# EAGLE design domus-silicea - M1 - Arduino Pro-Mini (EAGLE 7.3.0)
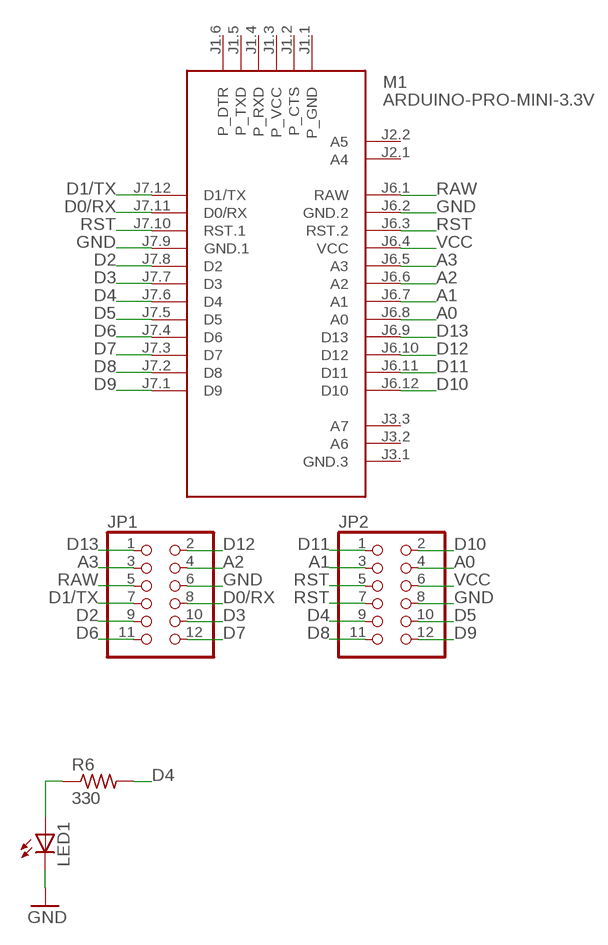
[diagram p0: schematic, sheet 1]

## Parts
JP1  PINHD-2X6  [2X06]
JP2  PINHD-2X6  [2X06]
LED1  LED5MM  [LED5MM]
M1  ARDUINO-PRO-MINI-3.3V  [ARDUINO-PRO-MINI]
R6  330  R-US_0204/7  [0204/7]

## Nets
A0: JP2.4 M1.J6.8(A0)
A1: JP2.3 M1.J6.7(A1)
A2: JP1.4 M1.J6.6(A2)
A3: JP1.3 M1.J6.5(A3)
D0/RX: JP1.8 M1.J7.11(D0/RX)
D1/TX: JP1.7 M1.J7.12(D1/TX)
D2: JP1.9 M1.J7.8(D2)
D3: JP1.10 M1.J7.7(D3)
D4: JP2.9 M1.J7.6(D4) R6.2
D5: JP2.10 M1.J7.5(D5)
D6: JP1.11 M1.J7.4(D6)
D7: JP1.12 M1.J7.3(D7)
D8: JP2.11 M1.J7.2(D8)
D9: JP2.12 M1.J7.1(D9)
D10: JP2.2 M1.J6.12(D10)
D11: JP2.1 M1.J6.11(D11)
D12: JP1.2 M1.J6.10(D12)
D13: JP1.1 M1.J6.9(D13)
GND: JP1.6 JP2.8 LED1.K(C) M1.J6.2(GND.2) M1.J7.9(GND.1)
N$6: LED1.A R6.1
RAW: JP1.5 M1.J6.1(RAW)
RST: JP2.5 JP2.7 M1.J6.3(RST.2) M1.J7.10(RST.1)
VCC: JP2.6 M1.J6.4(VCC)
Unconnected: M1.J1.1(P_GND) M1.J1.2(P_CTS) M1.J1.3(P_VCC) M1.J1.4(P_RXD) M1.J1.5(P_TXD) M1.J1.6(P_DTR) M1.J2.1(A4) M1.J2.2(A5) M1.J3.1(GND.3) M1.J3.2(A6) M1.J3.3(A7)

## Library data of the parts
JP1 JP2 = pinhead:PINHD-2X6: PIN HEADER
LED1 = led:LED: LED OSRAM: - CHIPLED LG R971, LG N971, LY N971, LG Q971, LY Q971, LO R971, LY R971 LH N974, LH R974 LS Q976, LO Q976, LY Q976 LO Q996 - Hyper CHIPLED LW Q18S LB Q993, LB Q99A, LB R99A - SideLED LS A670, LO A670, LY A670, LG A670, LP A670 LB A673, LV A673, LT A673, LW A673 LH A674 LY A675 LS A676, LA A676, LO A676, LY A676, LW A676 LS A679, LY A679, LG A679 - Hyper Micro SIDELED® LS Y876, LA Y876, LO Y876, LY Y876 LT Y87S - SmartLED LW L88C, LW L88S LB L89C, LB L89S, LG L890 LS L89K, LO L89K, LY L89K LS L896, LA L896, LO L896, LY L896 - TOPLED LS T670, LO T670, LY T670, LG T670, LP T670 LSG T670, LSP T670, LSY T670, LOP T670, LYG T670 LG T671, LOG T671, LSG T671 LB T673, LV T673, LT T673, LW T673 LH T674 LS T676, LA T676, LO T676, LY T676, LB T676, LH T676, LSB T676, LW T676 LB T67C, LV T67C, LT T67C, LS T67K, LO T67K, LY T67K, LW E67C LS E67B, LA E67B, LO E67B, LY E67B, LB E67C, LV E67C, LT E67C LW T67C LS T679, LY T679, LG T679 LS T770, LO T770, LY T770, LG T770, LP T770 LB T773, LV T773, LT T773, LW T773 LH T774 LS E675, LA E675, LY E675, LS T675 LS T776, LA T776, LO T776, LY T776, LB T776 LHGB T686 LT T68C, LB T68C - Hyper Mini TOPLED® LB M676 - Mini TOPLED Santana® LG M470 LS M47K, LO M47K, LY M47K Source: http://www.osram.convergy.de LUXEON: - LUMILED® LXK2-PW12-R00, LXK2-PW12-S00, LXK2-PW14-U00, LXK2-PW14-V00 LXK2-PM12-R00, LXK2-PM12-S00, LXK2-PM14-U00 LXK2-PE12-Q00, LXK2-PE12-R00, LXK2-PE12-S00, LXK2-PE14-T00, LXK2-PE14-U00 LXK2-PB12-K00, LXK2-PB12-L00, LXK2-PB12-M00, LXK2-PB14-N00, LXK2-PB14-P00, LXK2-PB14-Q00 LXK2-PR12-L00, LXK2-PR12-M00, LXK2-PR14-Q00, LXK2-PR14-R00 LXK2-PD12-Q00, LXK2-PD12-R00, LXK2-PD12-S00 LXK2-PH12-R00, LXK2-PH12-S00 LXK2-PL12-P00, LXK2-PL12-Q00, LXK2-PL12-R00 Source: www.luxeon.com KINGBRIGHT: KA-3528ASYC Source: www.kingbright.com
M1 = diy-modules:ARDUINO-PRO-MINI-*: Arduino Pro Mini
R6 = resistor:R-US_: RESISTOR, American symbol

## Board
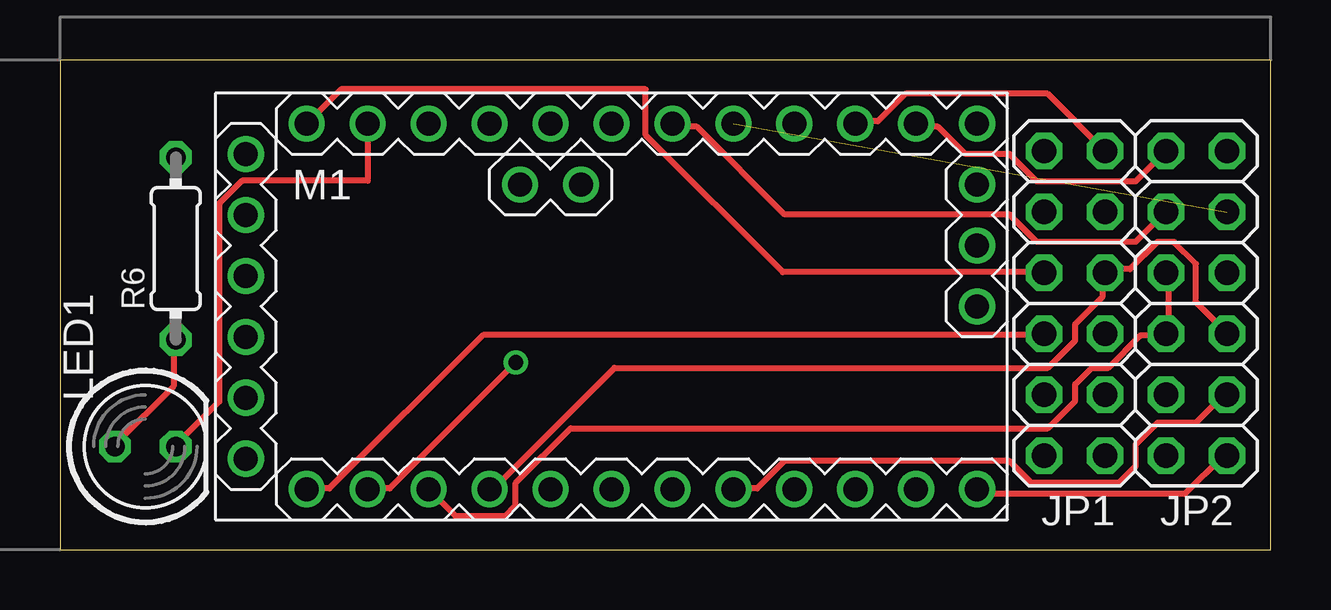
[diagram p1: board, top side]
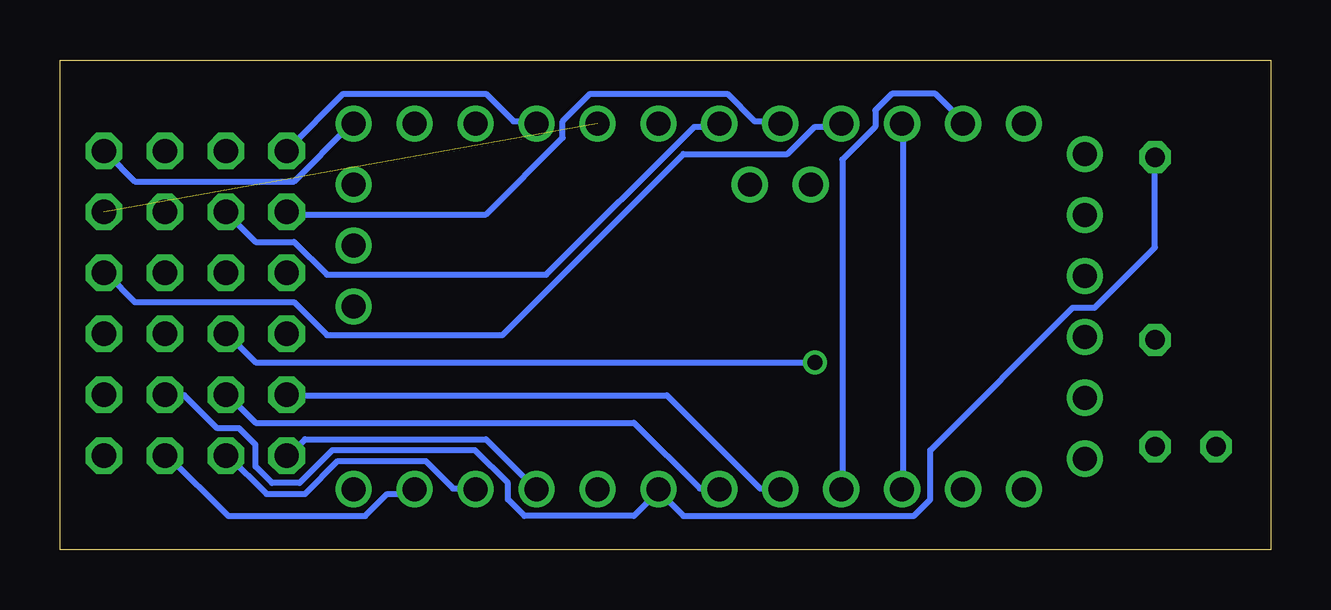
[diagram p2: board, bottom side, seen from below]

Size 50.47 x 20.44 mm. Coordinates in mm from the lower left corner, seen from the top.
Outline: 0,0 50.47,0 50.47,20.44 0,20.44 0,0
Copper layers (1*16): Top 0.035mm / dielectric 1.5mm / Bottom 0.035mm
Design rules "default": minimum track width 10mil, minimum drill 24mil, track to track 8mil, track to pad 8mil, pad to pad 8mil, via to via 8mil, smd to smd 8mil, copper to edge 40mil, drill to drill 8mil, minimum pad ring 10mil, minimum via ring 8mil, stop-mask expansion 4mil, vias tented up to drill 0mil, thermal gap 10mil

### Footprints (pad centres in the part's own frame; a part is rotated, then mirrored left to right if it is on the bottom)
2X06 = drill 1.016 octagon: 1 -6.35,-1.27; 2 -6.35,1.27; 3 -3.81,-1.27; 4 -3.81,1.27; 5 -1.27,-1.27; 6 -1.27,1.27; 7 1.27,-1.27; 8 1.27,1.27; 9 3.81,-1.27; 10 3.81,1.27; 11 6.35,-1.27; 12 6.35,1.27
LED5MM = drill 0.813 octagon: A -1.27,0; K 1.27,0
ARDUINO-PRO-MINI = drill 1: J1.1 -15.24,6.35; J1.2 -15.24,3.81; J1.3 -15.24,1.27; J1.4 -15.24,-1.27; J1.5 -15.24,-3.81; J1.6 -15.24,-6.35; J2.1 -1.27,5.08; J2.2 -3.81,5.08; J3.1 15.24,0; J3.2 15.24,2.54; J3.3 15.24,5.08; J6.1 -12.7,7.62; J6.2 -10.16,7.62; J6.3 -7.62,7.62; J6.4 -5.08,7.62; J6.5 -2.54,7.62; J6.6 0,7.62; J6.7 2.54,7.62; J6.8 5.08,7.62; J6.9 7.62,7.62; J6.10 10.16,7.62; J6.11 12.7,7.62; J6.12 15.24,7.62; J7.1 15.24,-7.62; J7.2 12.7,-7.62; J7.3 10.16,-7.62; J7.4 7.62,-7.62; J7.5 5.08,-7.62; J7.6 2.54,-7.62; J7.7 0,-7.62; J7.8 -2.54,-7.62; J7.9 -5.08,-7.62; J7.10 -7.62,-7.62; J7.11 -10.16,-7.62; J7.12 -12.7,-7.62
0204/7 = drill 0.813 octagon: 1 -3.81,0; 2 3.81,0

### Placement (x,y rotation side)
JP1  42.29,10.29 270 top
JP2  47.37,10.29 270 top
LED1  3.56,4.32 0 top
M1  22.99,10.16 0 top
R6  4.83,12.57 90 top

### Tracks (layer width: path | path; a pad name or v marks a point on that pad's centre or on a via)
A0  (1 unrouted)
A1
  Top 0.254: M1.J6.7 25.63,17.65 26.54,17.65 30.2,14 39.57,14 40.72,12.85 44.83,12.85 45.97,14 JP2.3
A2
  Bottom 0.254: JP1.4 42.32,12.85 40.72,12.85 39.34,11.48 30.2,11.48 24.03,17.65 23.11,17.65 M1.J6.6
A3
  Bottom 0.254: M1.J6.5 20.6,17.88 21.51,17.88 22.66,19.02 28.37,19.02 29.51,17.88 29.51,17.2 32.71,14 40.95,14 JP1.3
D0/RX  (via drill 0.61)
  Top 0.254: v19,7.82 13.74,2.57 12.83,2.57 M1.J7.11
  Bottom 0.254: v19,7.82 42.32,7.82 43.46,8.97 JP1.8
D1/TX
  Top 0.254: M1.J7.12 10.31,2.57 11.23,2.57 17.63,8.97 40.95,8.97 JP1.7
D2
  Bottom 0.254: M1.J7.8 20.6,2.57 21.29,2.57 25.17,6.45 40.95,6.45 JP1.9
D3
  Bottom 0.254: M1.J7.7 23.11,2.57 23.8,2.57 26.54,5.31 42.32,5.31 43.46,6.45 JP1.10
D4
  Bottom 0.254: R6.2 4.83,12.62 7.34,10.11 8.25,10.11 14.2,4.17 14.2,2.11 14.88,1.42 24.49,1.42 25.4,2.34 M1.J7.6 25.63,2.34 26.54,1.42 31.12,1.42 31.8,2.11 31.8,2.79 33.17,4.17 39.12,4.17 40.49,2.79 41.63,2.79 42.32,3.48 42.32,4.39 43,5.08 43.92,5.08 45.29,6.45 45.97,6.45 JP2.9
D5
  Top 0.254: M1.J7.5 28.14,2.57 29.06,2.57 30.2,3.71 39.57,3.71 40.49,2.79 44.15,2.79 44.83,3.48 44.83,4.39 45.74,5.31 47.35,5.31 48.49,6.45 JP2.10
D6
  Bottom 0.254: M1.J7.4 30.66,2.57 32.71,4.62 40.26,4.62 40.95,3.94 JP1.11
D7
  Top 0.127: 43.56,4.13 JP1.12
  Bottom 0.254: M1.J7.3 33.17,2.57 34.09,2.57 35.23,3.71 38.89,3.71 40.26,2.34 41.86,2.34 43.46,3.94 JP1.12
D8
  Bottom 0.254: M1.J7.2 35.69,2.34 36.83,2.34 37.74,1.42 43.46,1.42 45.97,3.94 JP2.11
D9
  Top 0.254: M1.J7.1 38.43,2.34 46.89,2.34 48.49,3.94 JP2.12
D10
  Bottom 0.254: M1.J6.12 38.43,17.65 40.72,15.37 47.35,15.37 48.49,16.51 JP2.2
D11
  Top 0.254: JP2.1 44.83,15.37 40.72,15.37 39.57,16.51 37.74,16.51 36.6,17.65 35.69,17.65 M1.J6.11
D12
  Top 0.254: JP1.2 41.17,19.02 35.23,19.02 34.09,17.88 33.17,17.88 M1.J6.10
D13
  Bottom 0.254: M1.J6.9 30.66,17.88 31.57,17.88 32.71,19.02 38.66,19.02 40.95,16.74 JP1.1
GND
  Top 0.254: JP2.8 48.49,9.2 47.35,10.34 47.35,11.94 46.43,12.85 45.74,12.85 44.6,11.71 43.69,11.71 JP1.6 43.46,11.48 43.46,10.57 42.32,9.42 42.32,8.74 41.17,7.6 23.11,7.6 18.09,2.57 M1.J7.9 | M1.J6.2 12.83,15.4 7.59,15.4 6.64,14.45 6.64,6.19 4.89,4.45 LED1.K
  Bottom 0.254: M1.J7.9 17.86,2.57 17.86,16.28 16.48,17.65 16.48,18.34 15.8,19.02 13.97,19.02 12.83,17.88 M1.J6.2
N$6
  Top 0.254: LED1.A 2.35,4.45 4.73,6.83 4.73,8.73 R6.1
RAW
  Top 0.254: M1.J6.1 11.72,19.21 24.42,19.21 24.42,17.3 30.13,11.59 40.93,11.59 JP1.5
RST
  Top 0.254: JP2.5 46.2,11.48 46.2,9.2 JP2.7 45.97,8.97 45.06,8.97 43.69,7.6 43,7.6 42.32,6.91 42.32,6.22 41.17,5.08 21.29,5.08 19,2.79 19,1.88 18.54,1.42 16.48,1.42 M1.J7.10
  Bottom 0.254: M1.J7.10 15.34,2.57 15.34,17.65 M1.J6.3
VCC
  Bottom 0.254: M1.J6.4 18.09,17.65 19,17.65 20.14,16.51 24.49,16.51 32.03,8.97 39.34,8.97 40.72,10.34 47.35,10.34 48.49,11.48 JP2.6